# EAGLE design signal_splitter (EAGLE 9.6.2)
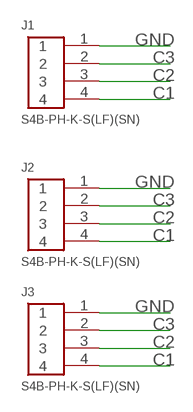
[diagram p0: schematic, sheet 1]

## Parts
J1  S4B-PH-K-S(LF)(SN)  [S4B-PH-K-S(LF)(SN)]
J2  S4B-PH-K-S(LF)(SN)  [S4B-PH-K-S(LF)(SN)]
J3  S4B-PH-K-S(LF)(SN)  [S4B-PH-K-S(LF)(SN)]

## Nets
C1: J1.4 J2.4 J3.4
C2: J1.3 J2.3 J3.3
C3: J1.2 J2.2 J3.2
GND: J1.1 J2.1 J3.1

## Library data of the parts
J1-J3 = Headers:S4B-PH-K-S(LF)(SN): CONN HEADER R/A 4POS 2MM Manufacturer's datasheet <http://www.jst-mfg.com/product/pdf/eng/ePH.pdf>; CREATED_BY: PCBLayout.com; DIGIKEY_PARTNO: 455-1721-ND; MANUFACTURER: JST Sales America Inc.; MPN: S4B-PH-K-S(LF)(SN)

## Board
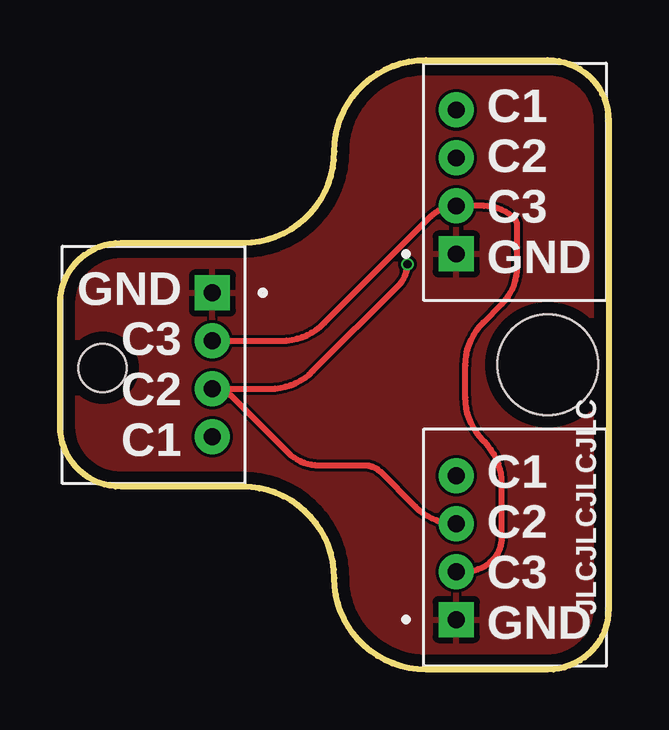
[diagram p1: board, top side]
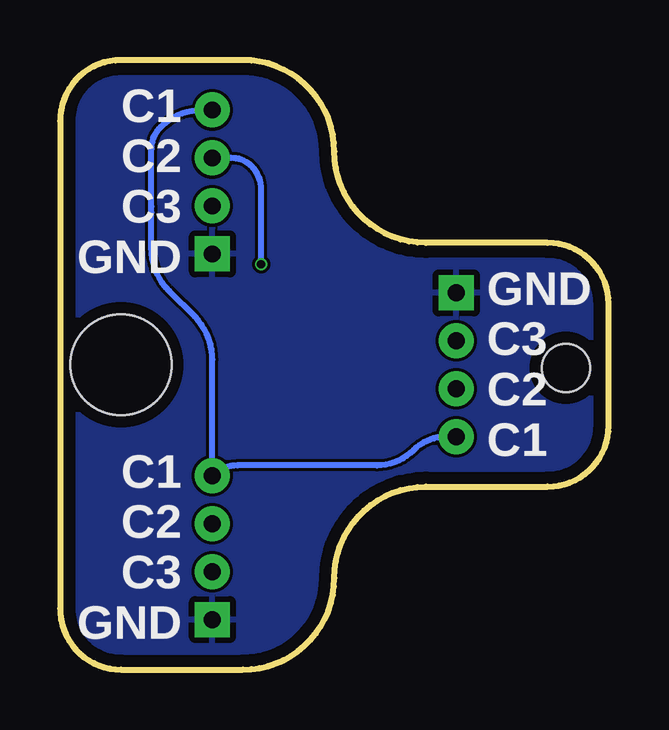
[diagram p2: board, bottom side, seen from below]

Size 22.86 x 25.4 mm. Coordinates in mm from the lower left corner, seen from the top.
Outline: 2.54,7.62 arc-90 0,10.16 0,15.24 arc-90 2.54,17.78 7.62,17.78 arc90 11.43,21.59 arc-90 15.24,25.4 20.32,25.4 arc-90 22.86,22.86 22.86,2.54 arc-90 20.32,0 15.24,0 arc-90 11.43,3.81 arc90 7.62,7.62 2.54,7.62
Copper layers (1*16): Top 0.035mm / dielectric 1.6mm / Bottom 0.035mm
Design rules "jlcpcb-2layers *": minimum track width 5mil, minimum drill 0.3mm, track to track 5mil, track to pad 5mil, pad to pad 5mil, via to via 5mil, smd to smd 5mil, copper to edge 0.5mm, drill to drill 6mil, minimum pad ring 15mil, minimum via ring 3mil, stop-mask expansion 4mil, vias tented up to drill 0mil, thermal gap 10mil
Holes 4.2 mm at 20.32,12.7
Holes 2 mm at 1.78,12.57

### Footprints (pad centres in the part's own frame; a part is rotated, then mirrored left to right if it is on the bottom)
S4B-PH-K-S(LF)(SN) = drill 0.7 square: 1 -3,0 | drill 0.7: 2 -1,0; 3 1,0; 4 3,0

### Placement (x,y rotation side)
J1  6.35,12.7 270 top
J2  16.51,5.08 90 top
J3  16.51,20.32 90 top

### Tracks (layer width: path | path; a pad name or v marks a point on that pad's centre or on a via)
C1
  Bottom 0.254: J1.4 6.79,9.7 arc-45 8.13,9.14 arc45 9.66,8.51 15.47,8.51 arc-45 J2.4 16.51,12.92 arc-45 17.25,14.71 18.31,15.77 arc45 19.05,17.56 19.05,19.05 19.05,19.3 19.05,21.69 arc45 18.67,22.61 arc45 16.95,23.32 J3.4
C2  (via drill 0.35)
  Top 0.254: J2.3 arc-45 14.8,6.79 13.34,8.25 arc45 12.72,8.51 10.79,8.51 arc-45 9.49,9.05 7.19,11.35 arc45 J1.3 8.74,11.7 arc45 10.54,12.44 14.12,16.02 arc45 v14.48,16.89
  Bottom 0.254: J3.3 15.74,21.32 arc45 14.86,20.95 arc45 14.48,20.04 v14.48,16.89
C3
  Top 0.254: J1.2 9.22,13.7 arc45 11.02,14.44 15.45,18.88 arc-45 J3.2 17.66,19.32 arc-45 18.92,18.8 arc-45 19.05,18.49 19.05,16.77 arc-45 18.41,15.24 17.64,14.46 arc45 16.89,12.66 16.89,11.34 arc45 17.64,9.54 17.67,9.51 arc-45 18.41,7.71 18.41,5.49 arc-45 18.03,4.57 arc-45 16.85,4.08 J2.2
GND
  pour Top: -1.27,16.51 -1.27,27.94 25.4,27.94 25.4,26.67 25.4,-2.54 -1.27,-2.54
  pour Bottom: -2.54,30.48 27.94,30.48 27.94,29.21 27.94,-5.08 -3.81,-5.08 -3.81,29.21 -3.81,30.48

### Text on the board
tPlace: C1 / C2 / C3 / GND | GND / C3 / C2 / C1 | JLCJLCJLCJLC | C1 / C2 / C3 / GND
bPlace: C1 / C2 / C3 / GND | GND / C3 / C2 / C1 | C1 / C2 / C3 / GND